# EAGLE design Controller_main (EAGLE 9.6.2)
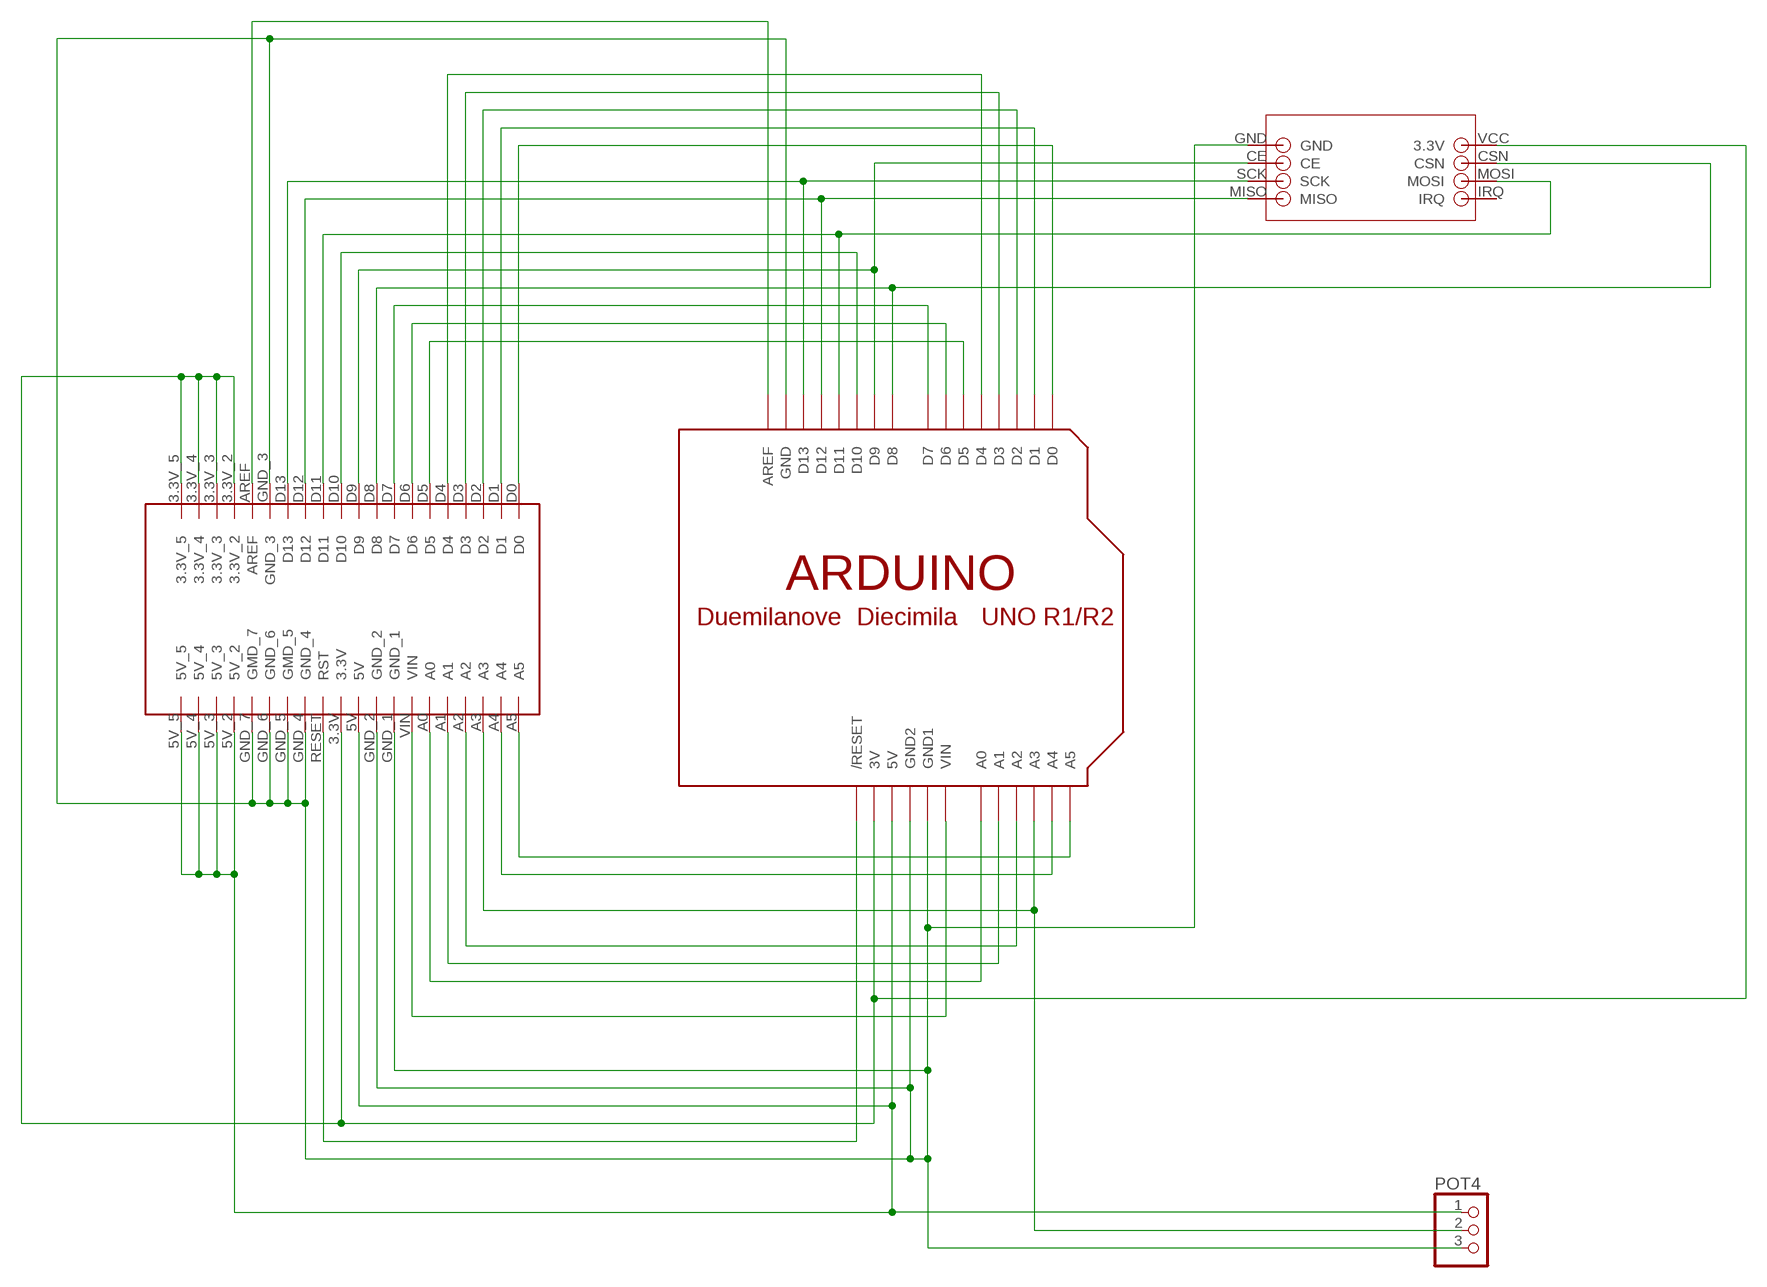
[diagram p0: schematic, sheet 1]

## Parts
2X40CONECTOR1  2X40_CONNECTOR  [2X40_PIN_CONNECTOR]
NRF24L1  NRF24L01  [NRF24L01]
POT4  PINHD-1X3  [1X03]
U$1  ARDUINOUNO  [ARDUINO]

## Nets
3.3V [5V, 3.3V, GND]: 2X40CONECTOR1.3.3V 2X40CONECTOR1.3.3V_2 2X40CONECTOR1.3.3V_3 2X40CONECTOR1.3.3V_4 2X40CONECTOR1.3.3V_5 NRF24L1.VCC(3.3V) U$1.3V
5V [5V, 3.3V, GND]: 2X40CONECTOR1.5V 2X40CONECTOR1.5V_2 2X40CONECTOR1.5V_3 2X40CONECTOR1.5V_4 2X40CONECTOR1.5V_5 POT4.1 U$1.5V
A0: 2X40CONECTOR1.A0 U$1.A0
A1: 2X40CONECTOR1.A1 U$1.A1
A2: 2X40CONECTOR1.A2 U$1.A2
A4: 2X40CONECTOR1.A4 U$1.A4
A5: 2X40CONECTOR1.A5 U$1.A5
AREF: 2X40CONECTOR1.AREF U$1.AREF
D0: 2X40CONECTOR1.D0 U$1.D0
D1: 2X40CONECTOR1.D1 U$1.D1
D2: 2X40CONECTOR1.D2 U$1.D2
D3: 2X40CONECTOR1.D3 U$1.D3
D4: 2X40CONECTOR1.D4 U$1.D4
D5: 2X40CONECTOR1.D5 U$1.D5
D6: 2X40CONECTOR1.D6 U$1.D6
D7: 2X40CONECTOR1.D7 U$1.D7
D8: 2X40CONECTOR1.D8 NRF24L1.CSN U$1.D8
D9: 2X40CONECTOR1.D9 NRF24L1.CE U$1.D9
D10: 2X40CONECTOR1.D10 U$1.D10
D11: 2X40CONECTOR1.D11 NRF24L1.MOSI U$1.D11
D12: 2X40CONECTOR1.D12 NRF24L1.MISO U$1.D12
D13: 2X40CONECTOR1.D13 NRF24L1.SCK U$1.D13
GND [5V, 3.3V, GND]: 2X40CONECTOR1.GND_1 2X40CONECTOR1.GND_2 2X40CONECTOR1.GND_3 2X40CONECTOR1.GND_4 2X40CONECTOR1.GND_5(GMD_5) 2X40CONECTOR1.GND_6 2X40CONECTOR1.GND_7(GMD_7) NRF24L1.GND POT4.3 U$1.GND U$1.GND1 U$1.GND2
POT4_A3: 2X40CONECTOR1.A3 POT4.2 U$1.A3
RESET: 2X40CONECTOR1.RESET(RST) U$1.RESET(/RESET)
VIN [5V, 3.3V, GND]: 2X40CONECTOR1.VIN U$1.VIN
Unconnected: NRF24L1.IRQ

## Library data of the parts
2X40CONECTOR1 = 2x40 Connector:2X40_CONNECTOR
NRF24L1 = nRF24L01:NRF24L01
POT4 = pinhead:PINHD-1X3: PIN HEADER
U$1 = Arduino:ARDUINO: Arduino Diecimila/Duemilanove Make a shield with ease, this package has all the named pins as well as the two mounting drill holes and an outline of the USB and DC power connector. The outline is on the DIMENSION layer, so if your board house uses it they will cut the outline to match. http://www.ladyada.net/library/pcb/eaglelibrary.html

## Net classes
0 default: width 1 mm, clearance 0.254 mm
1 5V, 3.3V, GND: width 2 mm, clearance 0.381 mm

## Board
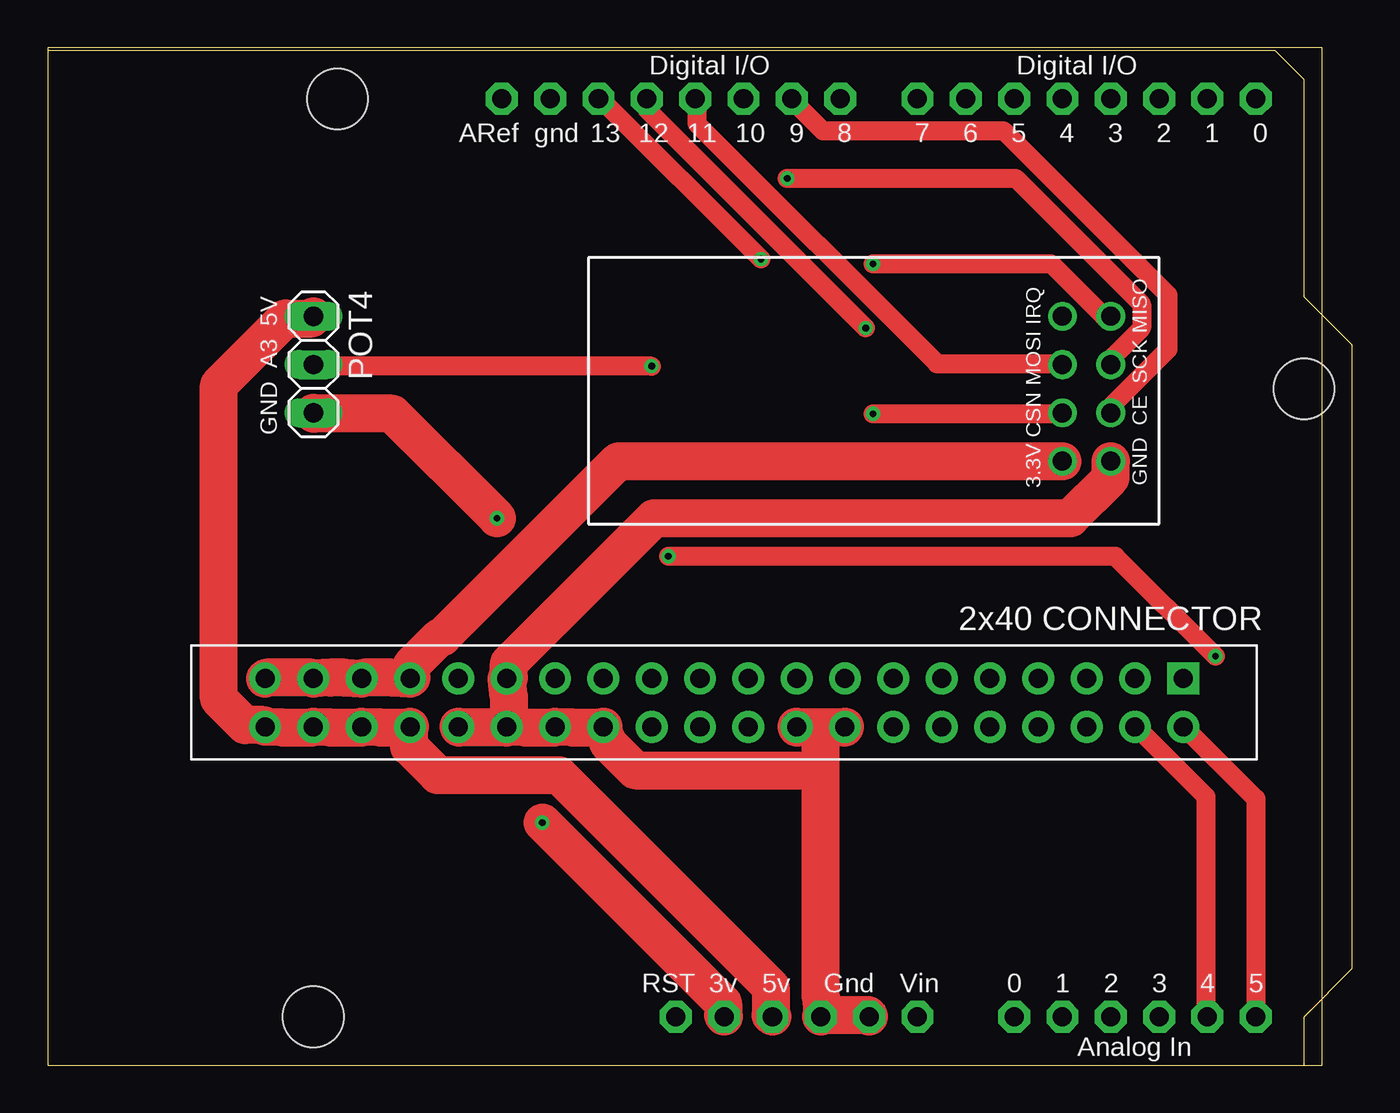
[diagram p1: board, top side]
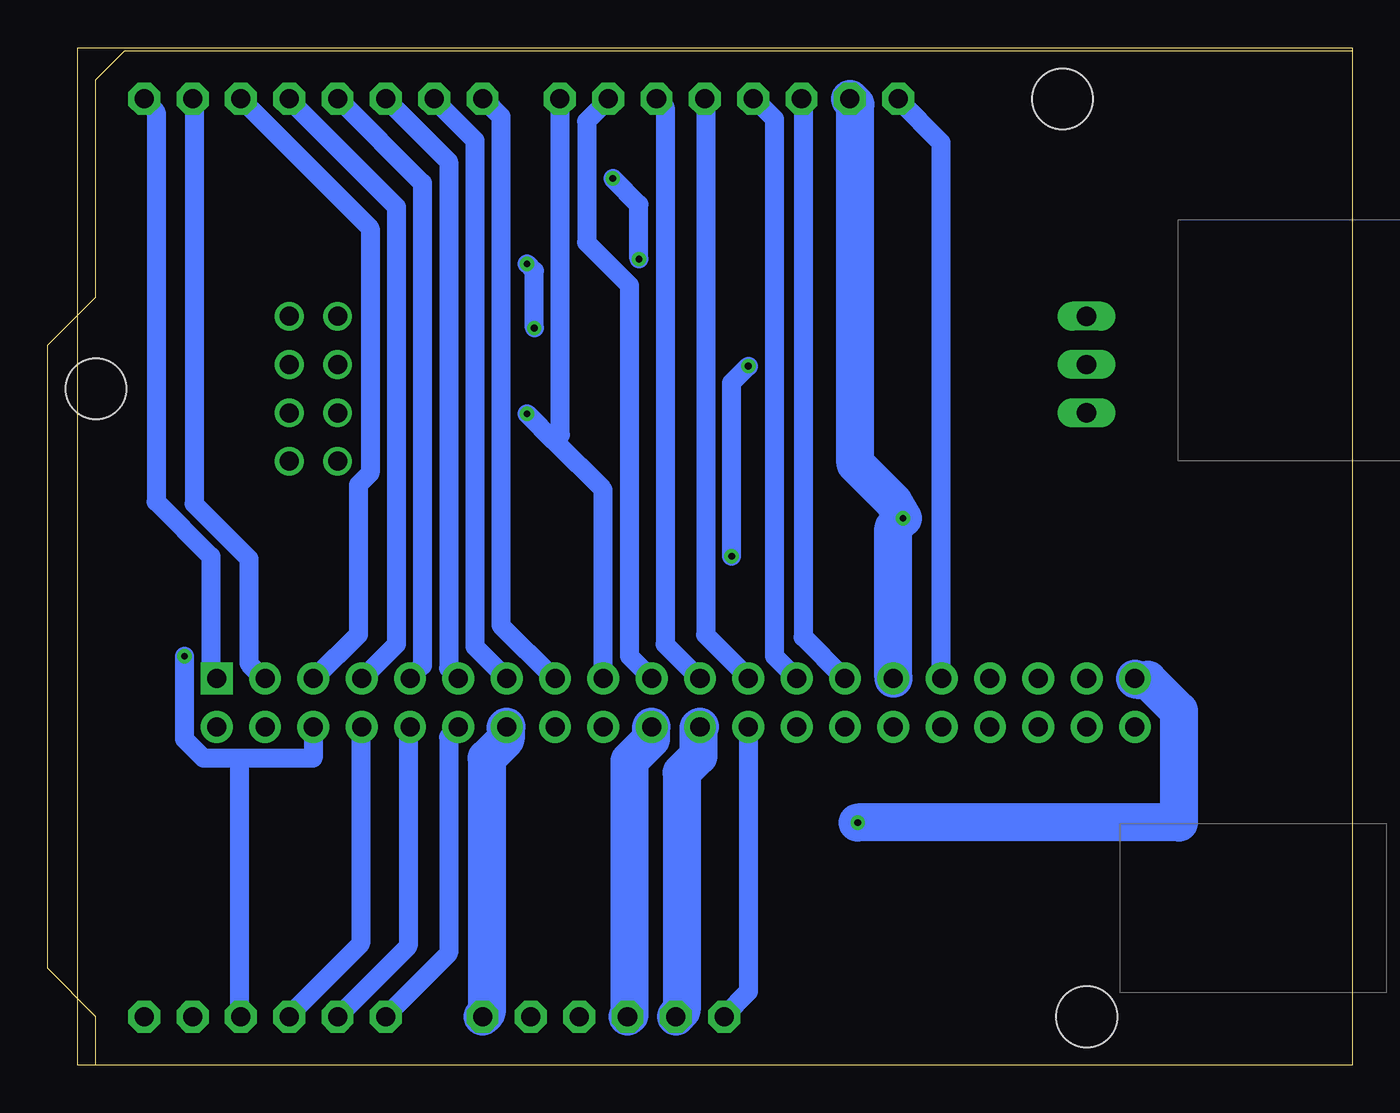
[diagram p2: board, bottom side, seen from below]

Size 67 x 53.5 mm. Coordinates in mm from the lower left corner, seen from the top.
Outline: 0,0 67,0 67,53.5 0,53.5 0,0
Copper layers (1*16): Top 0.035mm / dielectric 1.5mm / Bottom 0.035mm
Design rules "default": minimum track width 6mil, minimum drill 0.35mm, track to track 6mil, track to pad 6mil, pad to pad 6mil, via to via 6mil, smd to smd 6mil, copper to edge 40mil, drill to drill 6mil, minimum pad ring 10mil, minimum via ring 8mil, stop-mask expansion 4mil, vias tented up to drill 0mil, thermal gap 10mil

### Footprints (pad centres in the part's own frame; a part is rotated, then mirrored left to right if it is on the bottom)
2X40_PIN_CONNECTOR = drill 1 pad 1.676: 3.3V 22.86,0; 3.3V_2 7.62,2.54; 3.3V_3 5.08,2.54; 3.3V_4 2.54,2.54; 3.3V_5 0,2.54; 5V 25.4,0; 5V_2 7.62,0; 5V_3 5.08,0; 5V_4 2.54,0; 5V_5 0,0; A0 35.56,0; A1 38.1,0; A2 40.64,0; A3 43.18,0; A4 45.72,0; A5 48.26,0; AREF 10.16,2.54; D1 45.72,2.54; D2 43.18,2.54; D3 40.64,2.54; D4 38.1,2.54; D5 35.56,2.54; D6 33.02,2.54; D7 30.48,2.54; D8 27.94,2.54; D9 25.4,2.54; D10 22.86,2.54; D11 20.32,2.54; D12 17.78,2.54; D13 15.24,2.54; GND_1 30.48,0; GND_2 27.94,0; GND_3 12.7,2.54; GND_4 17.78,0; GND_5 15.24,0; GND_6 12.7,0; GND_7 10.16,0; RESET 20.32,0; VIN 33.02,0 | drill 1 pad 1.676 square: D0 48.26,2.54
NRF24L01 = drill 1: CE 2.54,7.62; CSN 5.08,7.62; GND 2.54,10.16; IRQ 5.08,2.54; MISO 2.54,2.54; MOSI 5.08,5.08; SCK 2.54,5.08; VCC 5.08,10.16
1X03 = drill 1.016 long: 1 -2.54,0; 2 0,0; 3 2.54,0
ARDUINO = drill 1 pad 1.676 octagon: 3V 35.56,2.54; 5V 38.1,2.54; A0 50.8,2.54; A1 53.34,2.54; A2 55.88,2.54; A3 58.42,2.54; A4 60.96,2.54; A5 63.5,2.54; AREF 23.876,50.8; D0 63.5,50.8; D1 60.96,50.8; D2 58.42,50.8; D3 55.88,50.8; D4 53.34,50.8; D5 50.8,50.8; D6 48.26,50.8; D7 45.72,50.8; D8 41.656,50.8; D9 39.116,50.8; D10 36.576,50.8; D11 34.036,50.8; D12 31.496,50.8; D13 28.956,50.8; GND 26.416,50.8; GND1 43.18,2.54; GND2 40.64,2.54; RESET 33.02,2.54; VIN 45.72,2.54 | hole 3.2: 15.24,50.8; 66.04,35.56; 13.97,2.54

### Placement (x,y rotation side)
2X40CONECTOR1  11.43,17.78 0 top
NRF24L1  58.42,41.91 180 top
POT4  13.97,36.83 270 top
U$1  0,0 0 top

### Tracks (layer width: path | path; a pad name or v marks a point on that pad's centre or on a via)
3.3V  (via drill 0.35)
  Top 2: 2X40CONECTOR1.3.3V_5 11.5,20.38 13.88,20.38 2X40CONECTOR1.3.3V_4 14.88,20.38 15.62,20.38 2X40CONECTOR1.3.3V_3 16.62,20.38 18.12,20.38 2X40CONECTOR1.3.3V_2 19.12,20.38 19.12,21 20.62,22.5 20.75,22.5 30,31.75 NRF24L1.VCC | v26,12.75 35.5,3.25 35.5,2.62 U$1.3V
  Bottom 2: U$1.3V 35.5,2.62 35.25,2.88 35.25,15.38 34.38,16.25 34.38,17.75 2X40CONECTOR1.3.3V | v26,12.75 9.12,12.75 9.12,18.62 10.75,20.25 11.38,20.25 2X40CONECTOR1.3.3V_5
5V
  Top 2: POT4.1 13.88,39.25 12.5,39.25 9,35.75 9,19.25 10.38,17.88 11.38,17.88 2X40CONECTOR1.5V_5 12.38,17.75 13.88,17.75 2X40CONECTOR1.5V_4 14.88,17.75 16.5,17.75 2X40CONECTOR1.5V_3 17.5,17.75 19,17.75 | 19,17.75 2X40CONECTOR1.5V_2 | U$1.5V 38,2.62 38,4.12 26.88,15.25 20.5,15.25 19,16.75 19,17.75
  Bottom 2: U$1.5V 38,2.62 38,16 36.88,17.12 36.88,17.75 2X40CONECTOR1.5V
A0
  Bottom 1: U$1.A0 50.75,2.62 47.5,5.88 47.5,17.25 47,17.75 2X40CONECTOR1.A0
A1
  Bottom 1: U$1.A1 53.25,2.62 49.62,6.25 49.62,17.75 2X40CONECTOR1.A1
A2
  Bottom 1: U$1.A2 55.88,2.62 52.12,6.38 52.12,17.75 2X40CONECTOR1.A2
A4
  Top 1: U$1.A4 60.88,2.62 60.88,14.12 57.25,17.75 2X40CONECTOR1.A4
A5
  Top 1: U$1.A5 63.5,14 59.75,17.75 2X40CONECTOR1.A5
AREF
  Bottom 1: 2X40CONECTOR1.AREF 21.62,20.38 21.62,48.5 23.88,50.75 U$1.AREF
D0
  Bottom 1: 2X40CONECTOR1.D0 59.75,20.38 60,20.62 60,26.75 62.88,29.62 62.88,50.12 63.5,50.75 U$1.D0
D1
  Bottom 1: 2X40CONECTOR1.D1 57.25,20.38 58,21.12 58,26.62 60.88,29.5 60.88,50.75 U$1.D1
D2
  Bottom 1: 2X40CONECTOR1.D2 54.5,20.38 52.25,22.62 52.25,30.5 51.62,31.12 51.62,44 58.38,50.75 U$1.D2
D3
  Bottom 1: 2X40CONECTOR1.D3 52,20.38 50.25,22.12 50.25,45.12 55.88,50.75 U$1.D3
D4
  Bottom 1: 2X40CONECTOR1.D4 49.5,20.38 48.88,21 48.88,46.38 53.25,50.75 U$1.D4
D5
  Bottom 1: U$1.D5 47.5,47.5 47.5,20.88 47,20.38 2X40CONECTOR1.D5
D6
  Bottom 1: 2X40CONECTOR1.D6 44.5,20.38 46.12,22 46.12,48.62 48.25,50.75 U$1.D6
D7
  Bottom 1: 2X40CONECTOR1.D7 42,20.38 44.75,23.12 44.75,49.88 45.62,50.75 U$1.D7
D8  (via drill 0.35)
  Top 1: v43.38,34.25 53.25,34.25 NRF24L1.CSN
  Bottom 1: 41.94,32.81 39.38,30.25 39.38,20.38 2X40CONECTOR1.D8 | 41.94,32.81 v43.38,34.25 | U$1.D8 41.62,50.75 41.62,33.12 41.94,32.81
D9
  Top 1: NRF24L1.CE 56,34.38 56,34.75 58.88,37.62 58.88,40.5 50.25,49.12 40.75,49.12 39.12,50.75 U$1.D9
  Bottom 1: 2X40CONECTOR1.D9 36.88,20.38 38,21.5 38,41 40.25,43.25 40.25,49.62 39.12,50.75 U$1.D9
D10
  Bottom 1: 2X40CONECTOR1.D10 34.38,20.38 36.12,22.12 36.12,50.38 36.5,50.75 U$1.D10
D11
  Top 1: NRF24L1.MOSI 53.25,36.88 46.75,36.88 34.12,49.5 34.12,50.75 U$1.D11
  Bottom 1: 2X40CONECTOR1.D11 31.75,20.38 34,22.62 34,50.75 U$1.D11
D12  (via drill 0.35)
  Top 1: v43.38,42.12 52.75,42.12 55.5,39.38 NRF24L1.MISO | v43,38.75 31.5,50.25 31.5,50.75 U$1.D12
  Bottom 1: v43.38,42.12 43,41.75 v43,38.75 | 2X40CONECTOR1.D12 29.25,20.38 30.38,21.5 30.38,49.75 31.38,50.75 U$1.D12
D13  (via drill 0.35)
  Top 1: v38.88,46.62 50.88,46.62 57.5,40 57.5,38.75 56,37.25 56,36.88 NRF24L1.SCK | v37.5,42.38 29,50.88 U$1.D13
  Bottom 1: v38.88,46.62 37.5,45.25 v37.5,42.38 | 2X40CONECTOR1.D13 26.75,20.38 28.88,22.5 28.88,50.75 U$1.D13
GND  (via drill 0.35)
  Top 2: 40.62,17.75 41.88,17.75 2X40CONECTOR1.GND_1 | 40.62,17.75 39.38,17.75 2X40CONECTOR1.GND_2 | 40.75,2.62 43.12,2.62 U$1.GND1 | 40.75,2.62 U$1.GND2 | 40.62,15.5 40.62,3.62 40.75,2.62 | 40.62,15.5 40.62,17.75 | 2X40CONECTOR1.GND_7 21.62,17.75 24.12,17.75 2X40CONECTOR1.GND_6 | 2X40CONECTOR1.GND_6 25.12,17.75 26.62,17.75 2X40CONECTOR1.GND_5 27.62,17.75 29.12,17.75 | 29.12,17.75 2X40CONECTOR1.GND_4 | NRF24L1.GND 55.88,30.88 53.75,28.75 31.88,28.75 24.25,21.12 24.25,20.38 2X40CONECTOR1.GND_3 24.25,19.38 24.25,18.75 2X40CONECTOR1.GND_6 | v23.62,28.75 18.12,34.25 14,34.25 POT4.3 | 40.62,15.5 30.88,15.5 29.5,16.88 29.12,17.75
  Bottom 2: 2X40CONECTOR1.GND_3 24.12,20.38 24.12,28.25 v23.62,28.75 24.12,29.62 26.12,31.62 26.12,50.5 26.38,50.75 U$1.GND
POT4_A3  (via drill 0.35)
  Top 1: v31.75,36.75 14,36.75 POT4.2 | v32.62,26.75 56.12,26.75 v61.38,21.5
  Bottom 1: v31.75,36.75 32.62,35.88 v32.62,26.75 | v61.38,21.5 61.38,17.12 60.38,16.12 58.5,16.12 | 58.5,16.12 54.62,16.12 54.62,17.75 2X40CONECTOR1.A3 | 58.5,16.12 58.5,2.62 U$1.A3
RESET
  Bottom 1: 2X40CONECTOR1.RESET 31.75,3.88 33,2.62 U$1.RESET
VIN
  Bottom 2: U$1.VIN 45.62,2.62 45.5,2.75 45.5,16.12 44.5,17.12 44.5,17.75 2X40CONECTOR1.VIN

### Text on the board
tNames: GND A3 5V | 3.3V CSN MOSI IRQ | GND CE SCK MISO